# Altium schematic sheet 04_io.SchDoc
size B
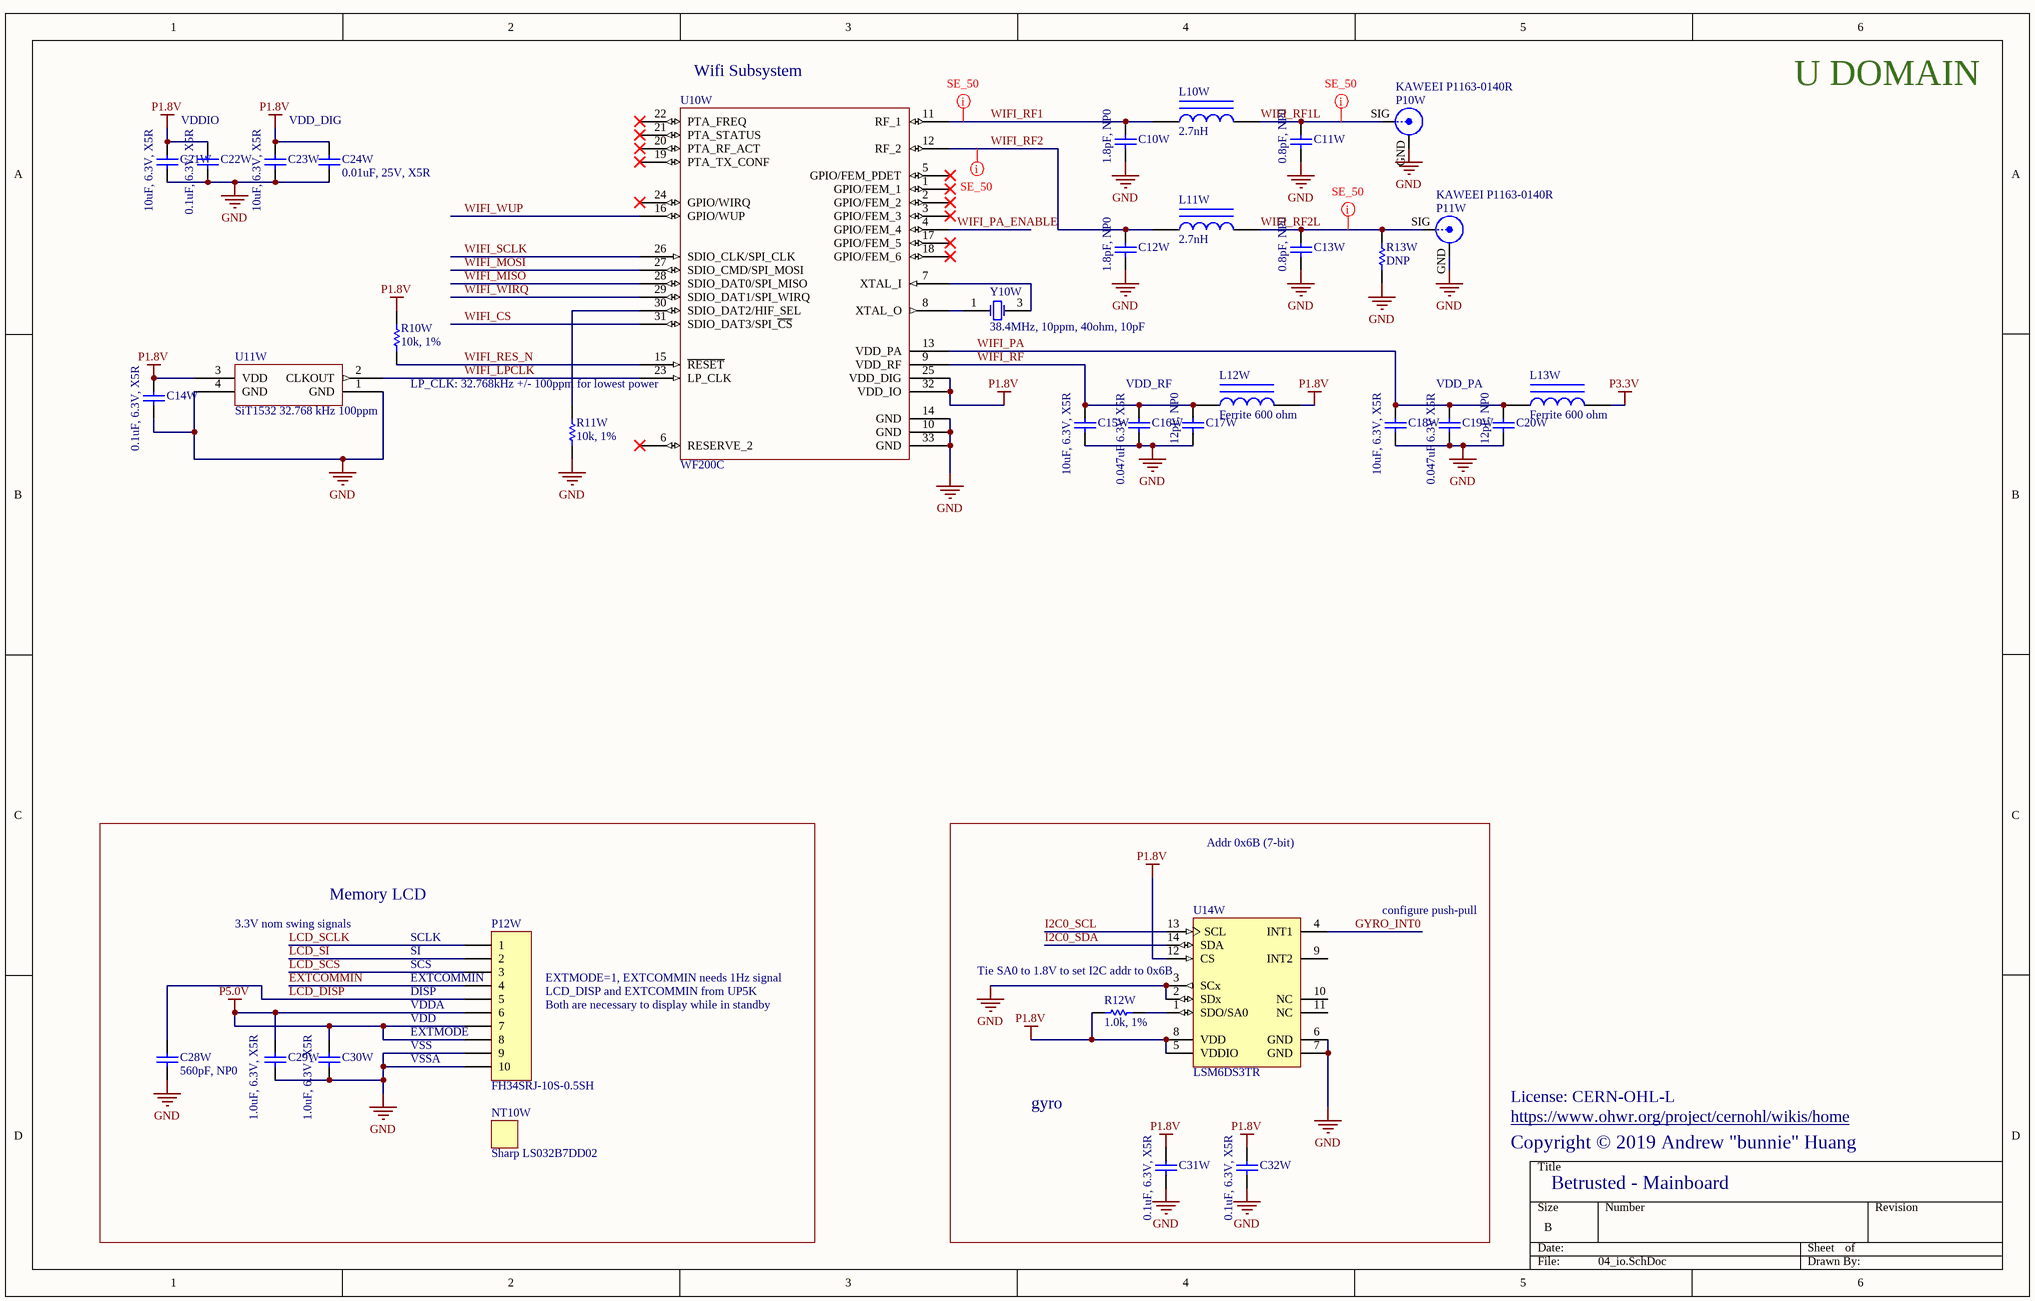
[diagram p0: 04_io.SchDoc]

## Parts
C10W  1.8pF, NP0  [B_CAP0201]
C11W  0.8pF, NP0  [B_CAP0201]
C12W  1.8pF, NP0  [B_CAP0201]
C13W  0.8pF, NP0  [B_CAP0201]
C14W  0.1uF, 6.3V, X5R  [B_CAP0201]
C15W  10uF, 6.3V, X5R  [B_CAP0603]
C16W  0.047uF 6.3V X5R  [B_CAP0201]
C17W  12pF, NP0  [B_CAP0201]
C18W  10uF, 6.3V, X5R  [B_CAP0603]
C19W  0.047uF 6.3V X5R  [B_CAP0201]
C20W  12pF, NP0  [B_CAP0201]
C21W  10uF, 6.3V, X5R  [B_CAP0603]
C22W  0.1uF, 6.3V, X5R  [B_CAP0201]
C23W  10uF, 6.3V, X5R  [B_CAP0603]
C24W  0.01uF, 25V, X5R  [B_RES0201]
C28W  560pF, NP0  [B_RES0201]
C29W  1.0uF, 6.3V, X5R  [B_CAP0201]
C30W  1.0uF, 6.3V, X5R  [B_CAP0201]
C31W  0.1uF, 6.3V, X5R  [B_CAP0201]
C32W  0.1uF, 6.3V, X5R  [B_CAP0201]
L10W  2.7nH  [B_IND0402]
L11W  2.7nH  [B_IND0402]
L12W  Ferrite 600 ohm  [B_IND0603]
L13W  Ferrite 600 ohm  [B_IND0603]
NT10W  Sharp LS032B7DD02
P10W  KAWEEI P1163-0140R  [HRS_U.FL]
P11W  KAWEEI P1163-0140R  [HRS_U.FL]
P12W  FH34SRJ-10S-0.5SH  [HRS_FH34SRJ-10S-0.5SH(50)]
R10W  10k, 1%  [B_RES0201]
R11W  10k, 1%  [B_RES0201]
R12W  1.0k, 1%  [B_RES0201]
R13W  DNP  [B_RES0201]
U10W  WF200C  [QFN40P400X400X90_HS-33N]
U11W  SiT1532 32.768 kHz 100ppm  [SiTIME_CSP]
U14W  LSM6DS3TR  [LGA-14_2500X3000X860_N]
Y10W  38.4MHz, 10ppm, 40ohm, 10pF  [XOSC_3.2_2.5]

## Blocks framed on the sheet
Memory LCD: C28W C29W C30W NT10W P12W
gyro: C31W C32W R12W U14W

## Nets
GND: C10W.2 C11W.2 C12W.2 C13W.2 C14W.2 C15W.2 C16W.2 C17W.2 C18W.2 C19W.2 C20W.2 C21W.2 C22W.2 C23W.2 C24W.2 C28W.2 C29W.1 C30W.1 C31W.2 C32W.2 P10W.GND(Y) P11W.GND(Y) P12W.9 P12W.10 R11W.2 R13W.2 U10W.10(GND) U10W.14(GND) U10W.33(GND) U11W.1(GND) U11W.4(GND) U14W.2(SDx) U14W.3(SCx) U14W.6(GND) U14W.7(GND)
P1.8V: C14W.1 C21W.1 C22W.1 C23W.1 C24W.1 C31W.1 C32W.1 L12W.2 R10W.1 R12W.2 U10W.25(VDD_DIG) U10W.32(VDD_IO) U11W.3(VDD) U14W.5(VDDIO) U14W.8(VDD) U14W.12(CS)
P3.3V: L13W.2
P5.0V: C29W.2 C30W.2 P12W.6 P12W.7 P12W.8
EXTCOMMIN: P12W.4
GYRO_INT0: U14W.4(INT1)
I2C0_SCL: U14W.13(SCL)
I2C0_SDA: U14W.14(SDA)
LCD_DISP: C28W.1 P12W.5
LCD_SCLK: P12W.1
LCD_SCS: P12W.3
LCD_SI: P12W.2
WIFI_CS: U10W.31(SDIO_DAT3/SPI_~{CS})
WIFI_LPCLK: U10W.23(LP_CLK) U11W.2(CLKOUT)
WIFI_MISO: U10W.28(SDIO_DAT0/SPI_MISO)
WIFI_MOSI: U10W.27(SDIO_CMD/SPI_MOSI)
WIFI_PA: C18W.1 C19W.1 C20W.1 L13W.1 U10W.13(VDD_PA)
WIFI_PA_ENABLE: U10W.4(GPIO/FEM_4)
WIFI_RES_N: R10W.2 U10W.15(~{RESET})
WIFI_RF: C15W.1 C16W.1 C17W.1 L12W.1 U10W.9(VDD_RF)
WIFI_RF1: C10W.1 L10W.1 U10W.11(RF_1)
WIFI_RF1L: C11W.1 L10W.2 P10W.SIG(X)
WIFI_RF2: C12W.1 L11W.1 U10W.12(RF_2)
WIFI_RF2L: C13W.1 L11W.2 P11W.SIG(X) R13W.1
WIFI_SCLK: U10W.26(SDIO_CLK/SPI_CLK)
WIFI_WIRQ: U10W.29(SDIO_DAT1/SPI_WIRQ)
WIFI_WUP: U10W.16(GPIO/WUP)
NetR11W_1: R11W.1 U10W.30(SDIO_DAT2/HIF_SEL)
NetR12W_1: R12W.1 U14W.1(SDO/SA0)
NetU10W_7: U10W.7(XTAL_I) Y10W.3(OSC2)
NetU10W_8: U10W.8(XTAL_O) Y10W.1(OSC1)

Not connected (* = marked no-connect by the designer): U10W 1(GPIO/FEM_1)* 2(GPIO/FEM_2)* 3(GPIO/FEM_3)* 5(GPIO/FEM_PDET)* 6(RESERVE_2)* 17(GPIO/FEM_5)* 18(GPIO/FEM_6)* 19(PTA_TX_CONF)* 20(PTA_RF_ACT)* 21(PTA_STATUS)* 22(PTA_FREQ)* 24(GPIO/WIRQ)*; U14W 9(INT2) 10(NC) 11(NC)

## Layout directives
net class SE_50: WIFI_RF1, WIFI_RF1L, WIFI_RF2, WIFI_RF2L

## Notes on the sheet
- (near U10W) Wifi Subsystem
- U DOMAIN
- VDDIO
- VDD_DIG
- (near U10W) LP_CLK: 32.768kHz +/- 100ppm for lowest power
- VDD_RF
- VDD_PA
- Addr 0x6B (7-bit)
- configure push-pull
- 3.3V nom swing signals
- SCLK
- SI
- SCS
- (near P12W) EXTCOMMIN
- EXTMODE=1, EXTCOMMIN needs 1Hz signal
- (near U14W) Tie SA0 to 1.8V to set I2C addr to 0x6B
- DISP
- VDDA
- VDD
- (near P12W) EXTMODE
- VSS
- LCD_DISP and EXTCOMMIN from UP5K
- Both are necessary to display while in standby
- VSSA
- License: CERN-OHL-L
- Copyright © 2019 Andrew "bunnie" Huang
- https://www.ohwr.org/project/cernohl/wikis/home
- Betrusted - Mainboard

## Library data of the parts
C10W C12W = Cap Semi: Capacitor (Semiconductor SIM Model); MPN: GRM0335C1H1R8BA01D; VENDOR: Murata; MYPN: C-1R8-50-NP0-0201
C11W C13W = Cap Semi: Capacitor (Semiconductor SIM Model); MPN: GRM0335C1ER80BA01D; VENDOR: Murata; MYPN: C-0R8-25-NP0-0201
C14W C22W C31W C32W = Cap Semi: Capacitor (Semiconductor SIM Model); MPN: CL03A104KQ3NNNC; VENDOR: Samsung; MYPN: C-104-6p3-X5R-0201
C15W C18W C21W C23W = Cap Semi: Capacitor (Semiconductor SIM Model); MPN: CL10A106MQ8NNNC; VENDOR: Samsung; MYPN: C-106-6.3-X5R-0603
C16W C19W = Cap Semi: Capacitor (Semiconductor SIM Model); MPN: CL03A473KQ3NNNC; VENDOR: Murata; MYPN: C-473-6P3-X5R-0201
C17W C20W = Cap Semi: Capacitor (Semiconductor SIM Model); MPN: GRM0335C1E120JA01D; VENDOR: Murata; MYPN: C-120-25-NP0-0201
C24W = Cap Semi: Capacitor (Semiconductor SIM Model); MPN: GRM033R61E103KA12D; VENDOR: Murata; MYPN: C-103-25-X5R-0201
C28W = Cap Semi: Capacitor (Semiconductor SIM Model); MPN: GRM0335C1E561JA01D; VENDOR: Murata; MYPN: C-561-25-NP0-0201
C29W C30W = Cap Semi: Capacitor (Semiconductor SIM Model); MPN: GRM033R60J105MEA2D; VENDOR: Murata; MYPN: C-105-6p3-X5R-0201
L10W L11W = Inductor Iron: Magnetic-Core Inductor; MPN: LQW15AN2N7C00; VENDOR: Murata; MYPN: L-LQW15AN2N7C00
L12W L13W = Inductor Iron: Magnetic-Core Inductor; MPN: BLM18AG601SN1D; VENDOR: Murata; MYPN: L-BLM18AG601SN1D
NT10W = NOTE: Placeholder for non-board BOM items; MYPN: NT-LCD-LS032B7DD02; MPN: LS032B7DD02; VENDOR: Sharp
P10W P11W = BNC: BNC Elbow Connector; MYPN: U.FL-R-SMT-1(10); LatestRevisionDate: 17-Jul-2002; LatestRevisionNote: Re-released for DXP Platform.; Publisher: Altium Limited; MPN: P1163-0140R; VENDOR: Kaweei
P12W = Header 10: Header, 10-Pin; VENDOR: Hirose; MYPN: J-FH34SRJ-10S-0.5SH(50/99); LatestRevisionDate: 17-Jul-2002; LatestRevisionNote: Re-released for DXP Platform.; Publisher: Altium Limited; MPN: FH34SRJ-10S-0.5SH
R10W R11W = Res1: Resistor; VENDOR: ANY; MYPN: R-103-1P-1_16W-0201; MPN: ANY
R12W = Res1: Resistor; VENDOR: ANY; MYPN: R-102-1P-1_16W-0201; MPN: ANY
R13W = Res1: Resistor; VENDOR: DNP; MYPN: DNP; MPN: DNP
U10W = WF200C(R): Wifi Network Coprocessor; VENDOR: SiLabs; MYPN: U-WF200C(R); MPN: WF200C
U11W = SiT1532: 10ppm ultra low power 32.768 kHz replacement; MPN: SIT1532AI-J4-DCC-32.768E; VENDOR: SiTime; MYPN: U-SIT1532AX-JX-DCC-32.768X
U14W = LSM6DS3TR: iNEMO Inertial Module: Always-on 3D Accelerometer and 3D Gyroscope, 1.71 to 3.6 V, -40 to 85 degC, 14-Pin LGA, RoHS, Tape and Reel; Sensing Distance: 2|4|6|8|16G; Number of Axis: 3; VENDOR: STMicroelectronics; Output Type: Digital; Lead Finish: GoldOverNickel; Max Processing Temp: 260; Screening Level: Industrial; Typical Supply Current: 1.25Milliamps; Operating Supply Voltage: 1.8volt; MYPN: U-LSM6DS3TR; Type: AccelerometerandGyroscope; Datasheet Version: Rev. 8, 02/2016; Datasheet URL: http://www2.st.com/content/ccc/resource/technical/document/datasheet/a3/f5/4f/ae/8e/44/41/d7/DM00133076.pdf/files/DM00133076.pdf/jcr:content/translations/en.DM00133076.pdf; Mounting: SurfaceMount; Manufacturer URL: http://www.st.com/; Operating Temperature: -40to85C; MPN: LSM6DS3TR
Y10W = XTAL: Crystal Oscillator; MPN: ECS-384-10-33B-CKY-TR; VENDOR: ECS; MYPN: X-38.4000-40OHM-10PF-10PPM; Published: 8-Jun-2000; LatestRevisionDate: 17-Jul-2002; LatestRevisionNote: Re-released for DXP Platform.; PackageReference: R38; Publisher: Altium Limited; PackageDescription: Crystal, Thru-Hole; 2 Leads; Body 3.1 x 8.2 mm (Dia.xH)